# EAGLE design push Button (EAGLE 9.6.0)
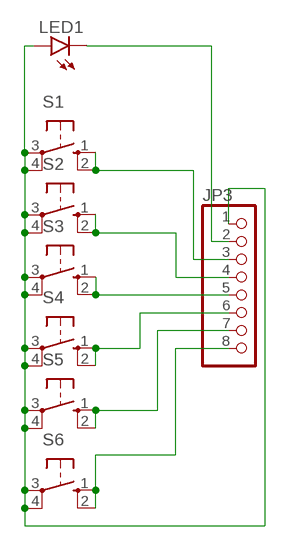
[diagram p0: schematic, sheet 1]

## Parts
JP3  PINHD-1X8  [1X08]
LED1  LED5MM  [LED5MM]
S1  10-XX  [B3F-10XX]
S2  10-XX  [B3F-10XX]
S3  10-XX  [B3F-10XX]
S4  10-XX  [B3F-10XX]
S5  10-XX  [B3F-10XX]
S6  10-XX  [B3F-10XX]

## Nets
N$1: JP3.1 LED1.A S1.3(P) S1.4(P1) S2.3(P) S2.4(P1) S3.3(P) S3.4(P1) S4.3(P) S4.4(P1) S5.3(P) S5.4(P1) S6.3(P) S6.4(P1)
N$2: JP3.8 S6.1(S) S6.2(S1)
N$3: JP3.7 S5.1(S) S5.2(S1)
N$4: JP3.6 S4.1(S) S4.2(S1)
N$5: JP3.5 S3.1(S) S3.2(S1)
N$6: JP3.4 S2.1(S) S2.2(S1)
N$7: JP3.3 S1.1(S) S1.2(S1)
N$8: JP3.2 LED1.K(C)

## Library data of the parts
JP3 = pinhead:PINHD-1X8: PIN HEADER
LED1 = led:LED: LED OSRAM: - CHIPLED LG R971, LG N971, LY N971, LG Q971, LY Q971, LO R971, LY R971 LH N974, LH R974 LS Q976, LO Q976, LY Q976 LO Q996 - Hyper CHIPLED LW Q18S LB Q993, LB Q99A, LB R99A - SideLED LS A670, LO A670, LY A670, LG A670, LP A670 LB A673, LV A673, LT A673, LW A673 LH A674 LY A675 LS A676, LA A676, LO A676, LY A676, LW A676 LS A679, LY A679, LG A679 - Hyper Micro SIDELED® LS Y876, LA Y876, LO Y876, LY Y876 LT Y87S - SmartLED LW L88C, LW L88S LB L89C, LB L89S, LG L890 LS L89K, LO L89K, LY L89K LS L896, LA L896, LO L896, LY L896 - TOPLED LS T670, LO T670, LY T670, LG T670, LP T670 LSG T670, LSP T670, LSY T670, LOP T670, LYG T670 LG T671, LOG T671, LSG T671 LB T673, LV T673, LT T673, LW T673 LH T674 LS T676, LA T676, LO T676, LY T676, LB T676, LH T676, LSB T676, LW T676 LB T67C, LV T67C, LT T67C, LS T67K, LO T67K, LY T67K, LW E67C LS E67B, LA E67B, LO E67B, LY E67B, LB E67C, LV E67C, LT E67C LW T67C LS T679, LY T679, LG T679 LS T770, LO T770, LY T770, LG T770, LP T770 LB T773, LV T773, LT T773, LW T773 LH T774 LS E675, LA E675, LY E675, LS T675 LS T776, LA T776, LO T776, LY T776, LB T776 LHGB T686 LT T68C, LB T68C - Hyper Mini TOPLED® LB M676 - Mini TOPLED Santana® LG M470 LS M47K, LO M47K, LY M47K Source: http://www.osram.convergy.de LUXEON: - LUMILED® LXK2-PW12-R00, LXK2-PW12-S00, LXK2-PW14-U00, LXK2-PW14-V00 LXK2-PM12-R00, LXK2-PM12-S00, LXK2-PM14-U00 LXK2-PE12-Q00, LXK2-PE12-R00, LXK2-PE12-S00, LXK2-PE14-T00, LXK2-PE14-U00 LXK2-PB12-K00, LXK2-PB12-L00, LXK2-PB12-M00, LXK2-PB14-N00, LXK2-PB14-P00, LXK2-PB14-Q00 LXK2-PR12-L00, LXK2-PR12-M00, LXK2-PR14-Q00, LXK2-PR14-R00 LXK2-PD12-Q00, LXK2-PD12-R00, LXK2-PD12-S00 LXK2-PH12-R00, LXK2-PH12-S00 LXK2-PL12-P00, LXK2-PL12-Q00, LXK2-PL12-R00 Source: www.luxeon.com KINGBRIGHT: KA-3528ASYC Source: www.kingbright.com
S1-S6 = switch-omron:10-XX: OMRON SWITCH; MPN: B3F-1000; OC_FARNELL: 176432; OC_NEWARK: 36M3542

## Board
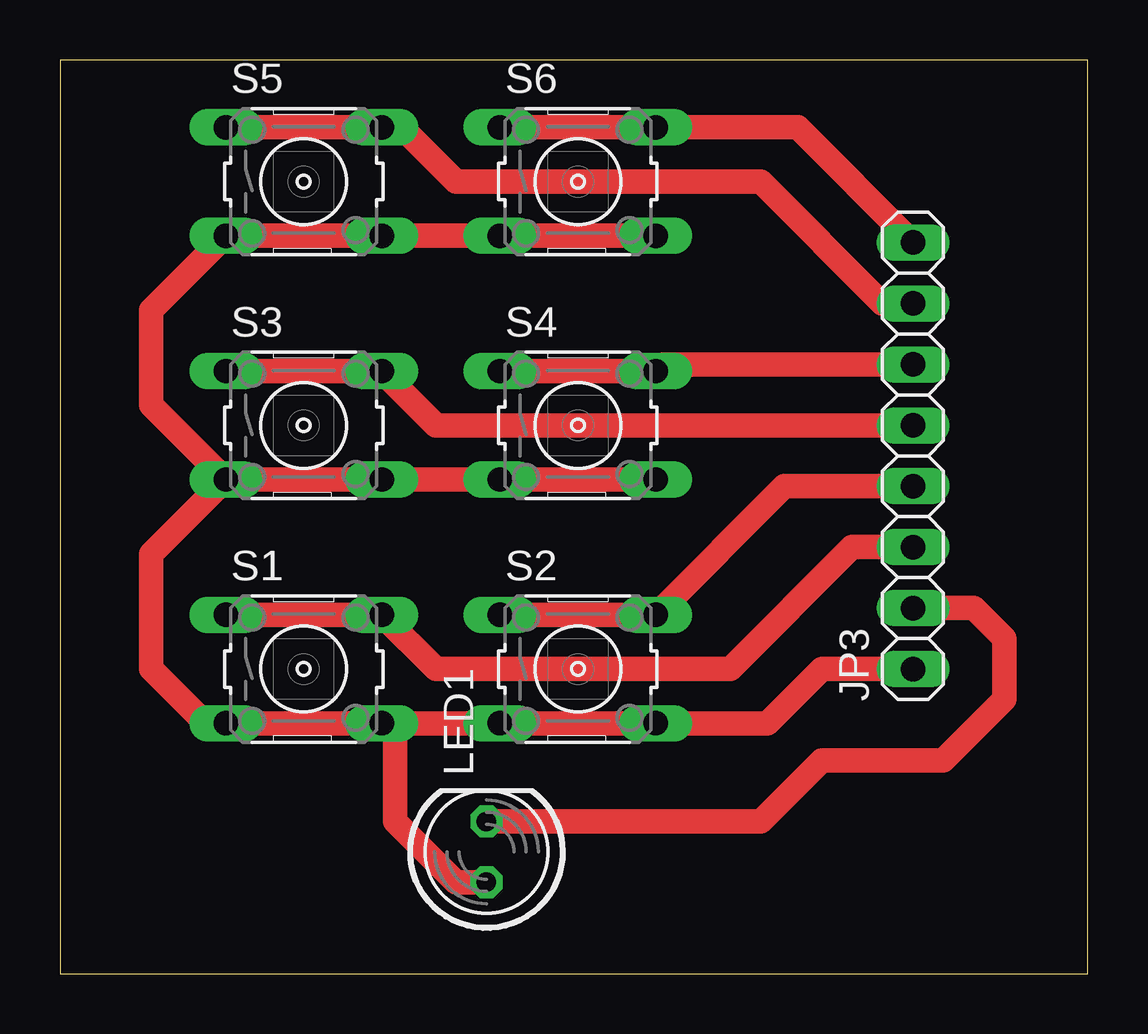
[diagram p1: board, top side]

Size 42.85 x 38.09 mm. Coordinates in mm from the lower left corner, seen from the top.
Outline: 0,0 42.85,0 42.85,38.09 0,38.09 0,0
Copper layers (1*16): Top 0.035mm / dielectric 1.5mm / Bottom 0.035mm
Design rules "default": minimum track width 6mil, minimum drill 0.35mm, track to track 6mil, track to pad 6mil, pad to pad 6mil, via to via 6mil, smd to smd 6mil, copper to edge 40mil, drill to drill 6mil, minimum pad ring 10mil, minimum via ring 8mil, stop-mask expansion 4mil, vias tented up to drill 0mil, thermal gap 10mil

### Footprints (pad centres in the part's own frame; a part is rotated, then mirrored left to right if it is on the bottom)
1X08 = drill 1.016 long: 1 -8.89,0; 2 -6.35,0; 3 -3.81,0; 4 -1.27,0; 5 1.27,0; 6 3.81,0; 7 6.35,0; 8 8.89,0
LED5MM = drill 0.813 octagon: A -1.27,0; K 1.27,0
B3F-10XX = drill 1.016 long: 1 -3.251,2.261; 2 3.251,2.261; 3 -3.251,-2.261; 4 3.251,-2.261

### Placement (x,y rotation side)
JP3  35.56,21.59 90 top
LED1  17.78,5.08 90 top
S1  10.16,12.7 0 top
S2  21.59,12.7 0 top
S3  10.16,22.86 0 top
S4  21.59,22.86 0 top
S5  10.16,33.02 0 top
S6  21.59,33.02 0 top

### Tracks (layer width: path | path; a pad name or v marks a point on that pad's centre or on a via)
N$1
  Top 1.016: S6.4 S6.3 S5.4 S5.3 3.81,27.66 3.81,23.7 S3.3 | S3.3 S3.4 S4.3 S4.4 | S1.4 S1.3 6.07,10.44 3.81,12.7 3.81,17.5 S3.3 | S1.4 S2.3 S2.4 29.49,10.44 31.75,12.7 JP3.1 | S1.4 13.97,9.88 13.97,6.35 16.51,3.81 LED1.A
N$2
  Top 1.016: S6.1 S6.2 30.76,35.28 JP3.8
N$3
  Top 1.016: S5.1 S5.2 14.25,35.28 16.51,33.02 29.21,33.02 34.29,27.94 JP3.7
N$4
  Top 1.016: S4.1 S4.2 25.12,25.4 JP3.6
N$5
  Top 1.016: S3.1 S3.2 15.67,22.86 JP3.5
N$6
  Top 1.016: S2.1 S2.2 | S2.2 25.12,15.24 | S2.2 30.2,20.32 JP3.4
N$7
  Top 1.016: S1.1 S1.2 | S1.2 14.25,14.96 | S1.2 15.67,12.7 27.94,12.7 33.02,17.78 JP3.3
N$8
  Top 1.016: LED1.K 29.21,6.35 31.75,8.89 36.83,8.89 39.37,11.43 39.37,13.97 38.1,15.24 JP3.2